# Altium schematic sheet DDR3L.SchDoc: DDR3L
size A3; SheetNumber: 9; SheetTotal: 10
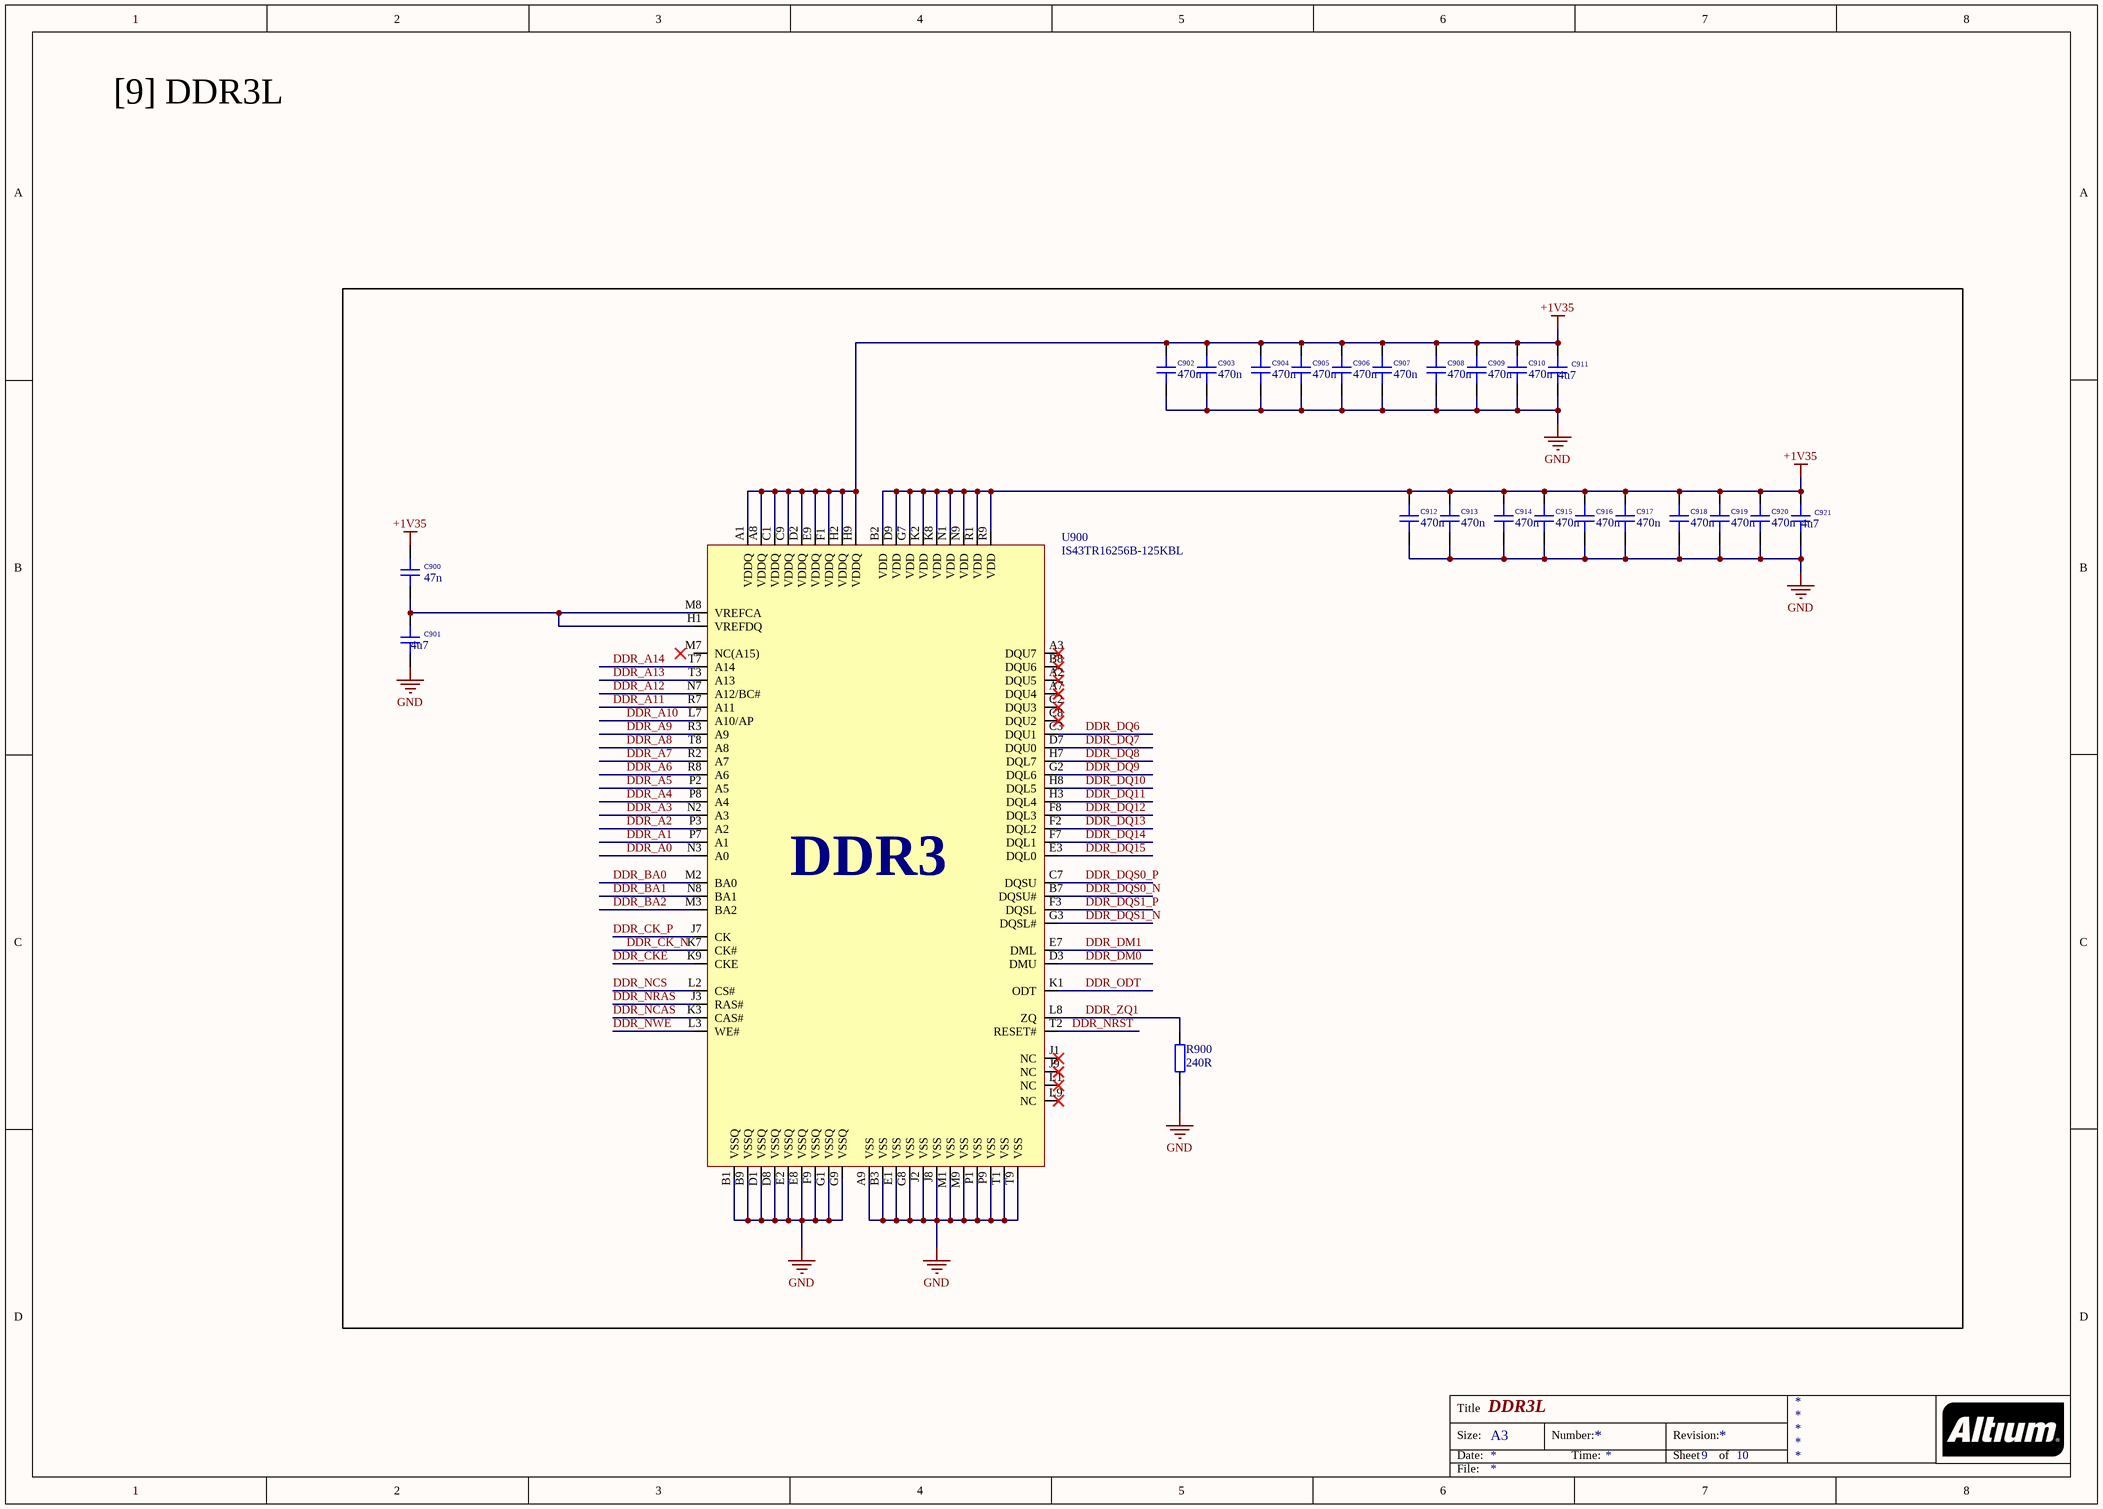
[diagram p0: DDR3L.SchDoc]

## Parts
C900  47n  [CAP_1210]
C901  4u7  [CAP_1210]
C902  470n  [CAP_1210]
C903  470n  [CAP_1210]
C904  470n  [CAP_1210]
C905  470n  [CAP_1210]
C906  470n  [CAP_1210]
C907  470n  [CAP_1210]
C908  470n  [CAP_1210]
C909  470n  [CAP_1210]
C910  470n  [CAP_1210]
C911  4u7  [CAP_1210]
C912  470n  [CAP_1210]
C913  470n  [CAP_1210]
C914  470n  [CAP_1210]
C915  470n  [CAP_1210]
C916  470n  [CAP_1210]
C917  470n  [CAP_1210]
C918  470n  [CAP_1210]
C919  470n  [CAP_1210]
C920  470n  [CAP_1210]
C921  4u7  [CAP_1210]
R900  240R  [RES_0402]
U900  IS43TR16256B-125KBL  [BGA96C80P9X16_900X1300X120]

## Nets
+1V35: C900.2 C902.2 C903.2 C904.2 C905.2 C906.2 C907.2 C908.2 C909.2 C910.2 C911.2 C912.2 C913.2 C914.2 C915.2 C916.2 C917.2 C918.2 C919.2 C920.2 C921.2 U900.A1(VDDQ) U900.A8(VDDQ) U900.B2(VDD) U900.C1(VDDQ) U900.C9(VDDQ) U900.D2(VDDQ) U900.D9(VDD) U900.E9(VDDQ) U900.F1(VDDQ) U900.G7(VDD) U900.H2(VDDQ) U900.H9(VDDQ) U900.K2(VDD) U900.K8(VDD) U900.N1(VDD) U900.N9(VDD) U900.R1(VDD) U900.R9(VDD)
GND: C901.1 C902.1 C903.1 C904.1 C905.1 C906.1 C907.1 C908.1 C909.1 C910.1 C911.1 C912.1 C913.1 C914.1 C915.1 C916.1 C917.1 C918.1 C919.1 C920.1 C921.1 R900.2 U900.A9(VSS) U900.B1(VSSQ) U900.B3(VSS) U900.B9(VSSQ) U900.D1(VSSQ) U900.D8(VSSQ) U900.E1(VSS) U900.E2(VSSQ) U900.E8(VSSQ) U900.F9(VSSQ) U900.G1(VSSQ) U900.G8(VSS) U900.G9(VSSQ) U900.J2(VSS) U900.J8(VSS) U900.M1(VSS) U900.M9(VSS) U900.P1(VSS) U900.P9(VSS) U900.T1(VSS) U900.T9(VSS)
DDR_A0: U900.N3(A0)
DDR_A1: U900.P7(A1)
DDR_A2: U900.P3(A2)
DDR_A3: U900.N2(A3)
DDR_A4: U900.P8(A4)
DDR_A5: U900.P2(A5)
DDR_A6: U900.R8(A6)
DDR_A7: U900.R2(A7)
DDR_A8: U900.T8(A8)
DDR_A9: U900.R3(A9)
DDR_A10: U900.L7(A10/AP)
DDR_A11: U900.R7(A11)
DDR_A12: U900.N7(A12/BC#)
DDR_A13: U900.T3(A13)
DDR_A14: U900.T7(A14)
DDR_BA0: U900.M2(BA0)
DDR_BA1: U900.N8(BA1)
DDR_BA2: U900.M3(BA2)
DDR_CK_N: U900.K7(CK#)
DDR_CK_P: U900.J7(CK)
DDR_CKE: U900.K9(CKE)
DDR_DM0: U900.D3(DMU)
DDR_DM1: U900.E7(DML)
DDR_DQ6: U900.C3(DQU1)
DDR_DQ7: U900.D7(DQU0)
DDR_DQ8: U900.H7(DQL7)
DDR_DQ9: U900.G2(DQL6)
DDR_DQ10: U900.H8(DQL5)
DDR_DQ11: U900.H3(DQL4)
DDR_DQ12: U900.F8(DQL3)
DDR_DQ13: U900.F2(DQL2)
DDR_DQ14: U900.F7(DQL1)
DDR_DQ15: U900.E3(DQL0)
DDR_DQS0_N: U900.B7(DQSU#)
DDR_DQS0_P: U900.C7(DQSU)
DDR_DQS1_N: U900.G3(DQSL#)
DDR_DQS1_P: U900.F3(DQSL)
DDR_NCAS: U900.K3(CAS#)
DDR_NCS: U900.L2(CS#)
DDR_NRAS: U900.J3(RAS#)
DDR_NRST: U900.T2(RESET#)
DDR_NWE: U900.L3(WE#)
DDR_ODT: U900.K1(ODT)
DDR_ZQ1: R900.1 U900.L8(ZQ)
NetC900_1: C900.1 C901.2 U900.H1(VREFDQ) U900.M8(VREFCA)

Not connected (* = marked no-connect by the designer): U900 A2(DQU5)* A3(DQU7)* A7(DQU4)* B8(DQU6)* C2(DQU3)* C8(DQU2)* J1(NC)* J9(NC)* L1(NC)* L9(NC)* M7(NC(A15))

## Notes on the sheet
- [9] DDR3L
- Title
- Size:
- Date:
- A3
- Number:
- Time:
- Revision:
- Sheet
- of
- File:
- (in symbol IS43TR16256B-125KBL) DDR3

## Library data of the parts
C900-C921 = CAP_1210: Capacitor SMD 1210; Manufacturer: *; Manufacturer Part Number: *; Distributor Link: *; LCSC: *; Rating: *; Dielectric: *
R900 = RES_0402: Resistor SMD 0402; Manufacturer: *; Manufacturer Part Number: *; Distributor Link: *; LCSC: *
U900 = IS43TR16256B-125KBL: DRAM 4GBit, 1.5V, DDR3, 256Mx16, 1600MT/s @ 11-11-11, 96 ball BGA (9mm x13mm) RoHS; Manufacturer: ISSI; Manufacturer Part Number: IS43TR16256B-125KBL